# Altium schematic sheet CW313 PCIe Edge.SchDoc: Card Edge Connector + Headers
size Letter; Organization: NewAE Technology Inc.; Address1: 1083 Queen St., Suite 196; Address2: Halifax; Address3: NS; Address4: Canada B3H 0B2; SheetNumber: 2; SheetTotal: 4; SheetApproved: Yes
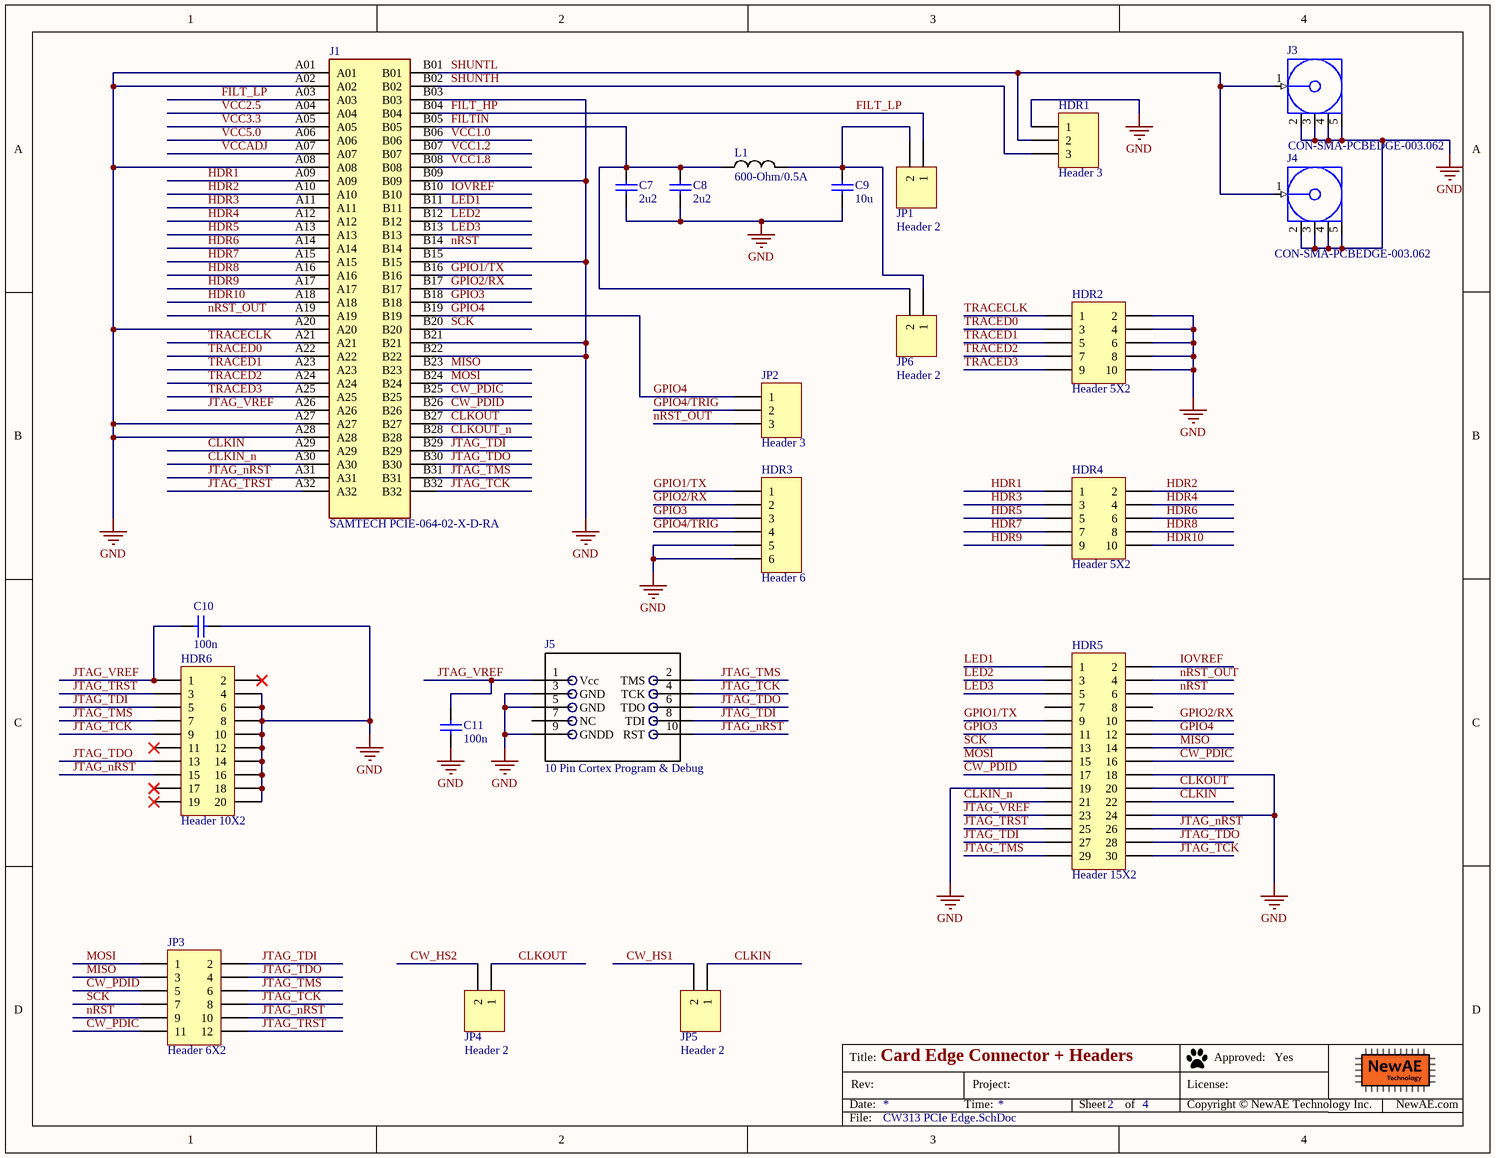
[diagram p0: CW313 PCIe Edge.SchDoc]

## Parts
C7  2u2  [CAPC0603_M]
C8  2u2  [CAPC0603_M]
C9  10u  [CAPC1206_M]
C10  100n  [CAPC0603_M]
C11  100n  [CAPC0603_M]
HDR1  Header 3  [HDR1X3]
HDR2  Header 5X2  [HDR2X5]
HDR3  Header 6  [HDR1X6]
HDR4  Header 5X2  [HDR2X5]
HDR5  Header 15X2  [HDR2X15]
HDR6  Header 10X2  [HDR2X10]
J1  SAMTECH PCIE-064-02-X-D-RA  [SAMTEC_PCIE-064-02-X-D-RA]
J3  CON-SMA-PCBEDGE-003.062  [CON-SMAM-PCB-EDGE062]
J4  CON-SMA-PCBEDGE-003.062  [CON-SMAM-PCB-EDGE062]
J5  10 Pin Cortex Program & Debug  [0.5mm_SMD_Header_5x2]
JP1  Header 2  [HDR1X2]
JP2  Header 3  [HDR1X3]
JP3  Header 6X2  [HDR2X6]
JP4  Header 2  [HDR1X2]
JP5  Header 2  [HDR1X2]
JP6  Header 2  [HDR1X2]
L1  600-Ohm/0.5A  [IND_0603]

## Nets
GND: C7.2 C8.2 C9.2 C10.2 C11.2 HDR1.1 HDR2.2 HDR2.4 HDR2.6 HDR2.8 HDR2.10 HDR3.5 HDR3.6 HDR5.18 HDR5.19 HDR5.24 HDR6.4 HDR6.6 HDR6.8 HDR6.10 HDR6.12 HDR6.14 HDR6.16 HDR6.18 HDR6.20 J1.A01 J1.A02 J1.A08 J1.A20 J1.A27 J1.A28 J1.B03 J1.B09 J1.B15 J1.B21 J1.B22 J3.2(GND) J3.3(GND) J3.4(GND) J3.5(GND) J4.2(GND) J4.3(GND) J4.4(GND) J4.5(GND) J5.3(GND) J5.5(GND) J5.9(GNDD)
CLKIN: HDR5.22 J1.A29 JP5.1
CLKIN_n: HDR5.21 J1.A30
CLKOUT: HDR5.20 J1.B27 JP4.1
CLKOUT_n: J1.B28
CW_HS1: JP5.2
CW_HS2: JP4.2
CW_PDIC: HDR5.16 J1.B25 JP3.11
CW_PDID: HDR5.17 J1.B26 JP3.5
FILT_HP: J1.A03 J1.B04 JP1.1  [also labelled FILT_LP]
FILTIN: C7.1 C8.1 J1.B05 JP6.2 L1.1
GPIO1/TX: HDR3.1 HDR5.9 J1.B16
GPIO2/RX: HDR3.2 HDR5.10 J1.B17
GPIO3: HDR3.3 HDR5.11 J1.B18
GPIO4: HDR5.12 J1.B19 JP2.1
GPIO4/TRIG: HDR3.4 JP2.2
HDR1: HDR4.1 J1.A09
HDR2: HDR4.2 J1.A10
HDR3: HDR4.3 J1.A11
HDR4: HDR4.4 J1.A12
HDR5: HDR4.5 J1.A13
HDR6: HDR4.6 J1.A14
HDR7: HDR4.7 J1.A15
HDR8: HDR4.8 J1.A16
HDR9: HDR4.9 J1.A17
HDR10: HDR4.10 J1.A18
IOVREF: HDR5.2 J1.B10
JTAG_nRST: HDR5.26 HDR6.15 J1.A31 J5.10(RST) JP3.10
JTAG_TCK: HDR5.30 HDR6.9 J1.B32 J5.4(TCK) JP3.8
JTAG_TDI: HDR5.27 HDR6.5 J1.B29 J5.8(TDI) JP3.2
JTAG_TDO: HDR5.28 HDR6.13 J1.B30 J5.6(TDO) JP3.4
JTAG_TMS: HDR5.29 HDR6.7 J1.B31 J5.2(TMS) JP3.6
JTAG_TRST: HDR5.25 HDR6.3 J1.A32 JP3.12
JTAG_VREF: C10.1 C11.1 HDR5.23 HDR6.1 J1.A26 J5.1(Vcc)
LED1: HDR5.1 J1.B11
LED2: HDR5.3 J1.B12
LED3: HDR5.5 J1.B13
MISO: HDR5.14 J1.B23 JP3.3
MOSI: HDR5.15 J1.B24 JP3.1
nRST: HDR5.6 J1.B14 JP3.9
nRST_OUT: HDR5.4 J1.A19 JP2.3
SCK: HDR5.13 J1.B20 JP3.7
SHUNTH: HDR1.3 J1.B02
SHUNTL: HDR1.2 J1.B01 J3.1(Signal) J4.1(Signal)
TRACECLK: HDR2.1 J1.A21
TRACED0: HDR2.3 J1.A22
TRACED1: HDR2.5 J1.A23
TRACED2: HDR2.7 J1.A24
TRACED3: HDR2.9 J1.A25
VCC1.0: J1.B06
VCC1.2: J1.B07
VCC1.8: J1.B08
VCC2.5: J1.A04
VCC3.3: J1.A05
VCC5.0: J1.A06
VCCADJ: J1.A07
NetC9_1: C9.1 JP1.2 JP6.1 L1.2

Not connected (* = marked no-connect by the designer): HDR5 7 8; HDR6 2* 11* 17* 19*; J5 7(NC)

## Notes on the sheet
- Title:
- Date:
- Rev:
- Time:
- Project:
- Sheet
- of
- License:
- Copyright © NewAE Technology Inc.
- Approved:
- NewAE.com
- File:

## Library data of the parts
C7 C8 = CCHIP-2u2-0603-16V: 2u2, 0603; Manufacture 1: Taiyo Yuden; Manufacture Part Number 1: EMK107BJ225KA-T; Component Group: Capacitor; Case-EIA: 0603; Case-Metric: 1608; Rated Voltage: 16VDC; Part Number: CCHIP-2u2-0603-16V; Footprint: 0603; Pin Count: 2; Supplier 1: Digi-Key; Supplier Part Number 1: 587-1430-1-ND; Value: 2u2; Mounting Technology: SMT; Component Kind: Standard; Component Type: Standard
C9 = CCHIP-10u-1206: CAP CER 10UF 25V X7R 1206; Manufacture 1: Taiyo Yuden; Manufacture Part Number 1: TMK316AB7106KL-T; Component Group: Capacitor; Case-EIA: 1206; Case-Metric: 3216; Part Number: CCHIP-10u-1206; Footprint: 1206; Pin Count: 2; Supplier 1: Digi-Key; Supplier Part Number 1: 587-3486-1-ND; Value: 10u; Mounting Technology: SMT; Component Kind: Standard; Component Type: Standard
C10 C11 = CCHIP-100n-0603: 100n, 0603; Manufacture 1: Kemet; Manufacture Part Number 1: C0603C104K5RACTU; Component Group: Capacitor; Case-EIA: 0603; Case-Metric: 1608; Rated Voltage: 50VDC; Part Number: CCHIP-100n-0603; Footprint: 0603; Pin Count: 2; Supplier 1: Digi-Key; Supplier Part Number 1: 399-5089-2-ND; Value: 100n; Mounting Technology: SMT; Component Kind: Standard; Component Type: Standard
HDR1 JP2 = Header 3: Header, 3-Pin; LatestRevisionDate: 17-Jul-2002; LatestRevisionNote: Re-released for DXP Platform.; Publisher: Altium Limited
HDR2 HDR4 = Header 5X2: Header, 5-Pin, Dual row; LatestRevisionDate: 17-Jul-2002; LatestRevisionNote: Re-released for DXP Platform.; Publisher: Altium Limited
HDR3 = Header 6: Header, 6-Pin; LatestRevisionDate: 17-Jul-2002; LatestRevisionNote: Re-released for DXP Platform.; Publisher: Altium Limited
HDR5 = Header 15X2: Header, 15-Pin, Dual row; LatestRevisionDate: 17-Jul-2002; LatestRevisionNote: Re-released for DXP Platform.; Publisher: Altium Limited
HDR6 = Header 10X2: Header, 10-Pin, Dual row; LatestRevisionDate: 17-Jul-2002; LatestRevisionNote: Re-released for DXP Platform.; Publisher: Altium Limited
J1 = PCIE-064-02-S-D-RA: 1.00 mm PCI Express Edge Card Connector (Thick Gold); MF: Samtec; PP Material Stack: 0; Package: None; Value: *; Availability: Unavailable; MP: PCIE-064-02-X-D-RA; Price: None; Part Number: PCIE-064-02-S-D-RA; Component Group: Connector; Footprint: PCIE-064-02-X-D-RA; Manufacture 1: Samtech; Manufacture Part Number 1: PCIE-064-02-X-D-RA; Pin Count: 64; Supplier 1: Mouser; Mounting Technology: Through-hole; RoHS: Yes; Component Kind: Standard; Component Type: Standard; PP Rotation: 0; PP Rotation1: 0
J3 J4 = CON-SMA-PCBEDGE-003.062: SMA Female Edge Mount Connector for 0.062" Thick Board; Part Number: CON-SMA-PCBEDGE-003.062; Component Group: Connector; Pin Count: 5; ComponentLink1Description: Manufacturer URL; ComponentLink1URL: http://www.linxtechnologies.com/; ComponentLink2Description: Datasheet; ComponentLink2URL: http://www.connectorcity.com/diagrams/SMA/CONSMA003.062.pdf; Component Kind: Standard; Component Type: Standard
J5 = Cortex_Debug_Header_10Pin: 10 Pin Cortex Program & Debug 0.5mm pitch; Manufacture 1: Samtec Inc; Manufacture Part Number 1: FTSH-105-01-L-DV-007-K; Component Group: Connector; PP Material Stack: 0; Part Number: Cortex_Debug_Header_10Pin; Pin Count: 10; Supplier 1: Digi-Key; Supplier Part Number 1: SAM9438-ND; Mounting Technology: SMT; RoHS: Yes; Component Kind: Standard; Component Type: Standard; PP Rotation: 0
JP1 JP4-JP6 = Header 2: Header, 2-Pin; LatestRevisionDate: 17-Jul-2002; LatestRevisionNote: Re-released for DXP Platform.; Publisher: Altium Limited
JP3 = Header 6X2: Header, 6-Pin, Dual row; LatestRevisionDate: 17-Jul-2002; LatestRevisionNote: Re-released for DXP Platform.; Publisher: Altium Limited
L1 = FBCHIP-600R-0603: 600 Ohm @ 100 MHz, 0.5A rated FB; Manufacture 1: Murata Electronics; Manufacture Part Number 1: BLM18AG601SN1D; Component Group: Inductor; Value: 600R/0.5A; Case-EIA: 0603; Case-Metric: 1608; PP Material Stack: 0; Part Number: FBCHIP-600R-0603; Footprint: 0603; Pin Count: 2; Supplier 1: Digi-Key; Supplier Part Number 1: 490-1014-2-ND; Rated Power: 0.5A; Component Kind: Standard; Component Type: Standard; PP Rotation: 0